# EasyEDA schematic 1-Schematic_MatrixBoard.json
TITLE: Sheet_1; REV: 1.0; Date: 2021-01-13; Sheet: 1/1; Drawn By: donkovs; Company: Your Company
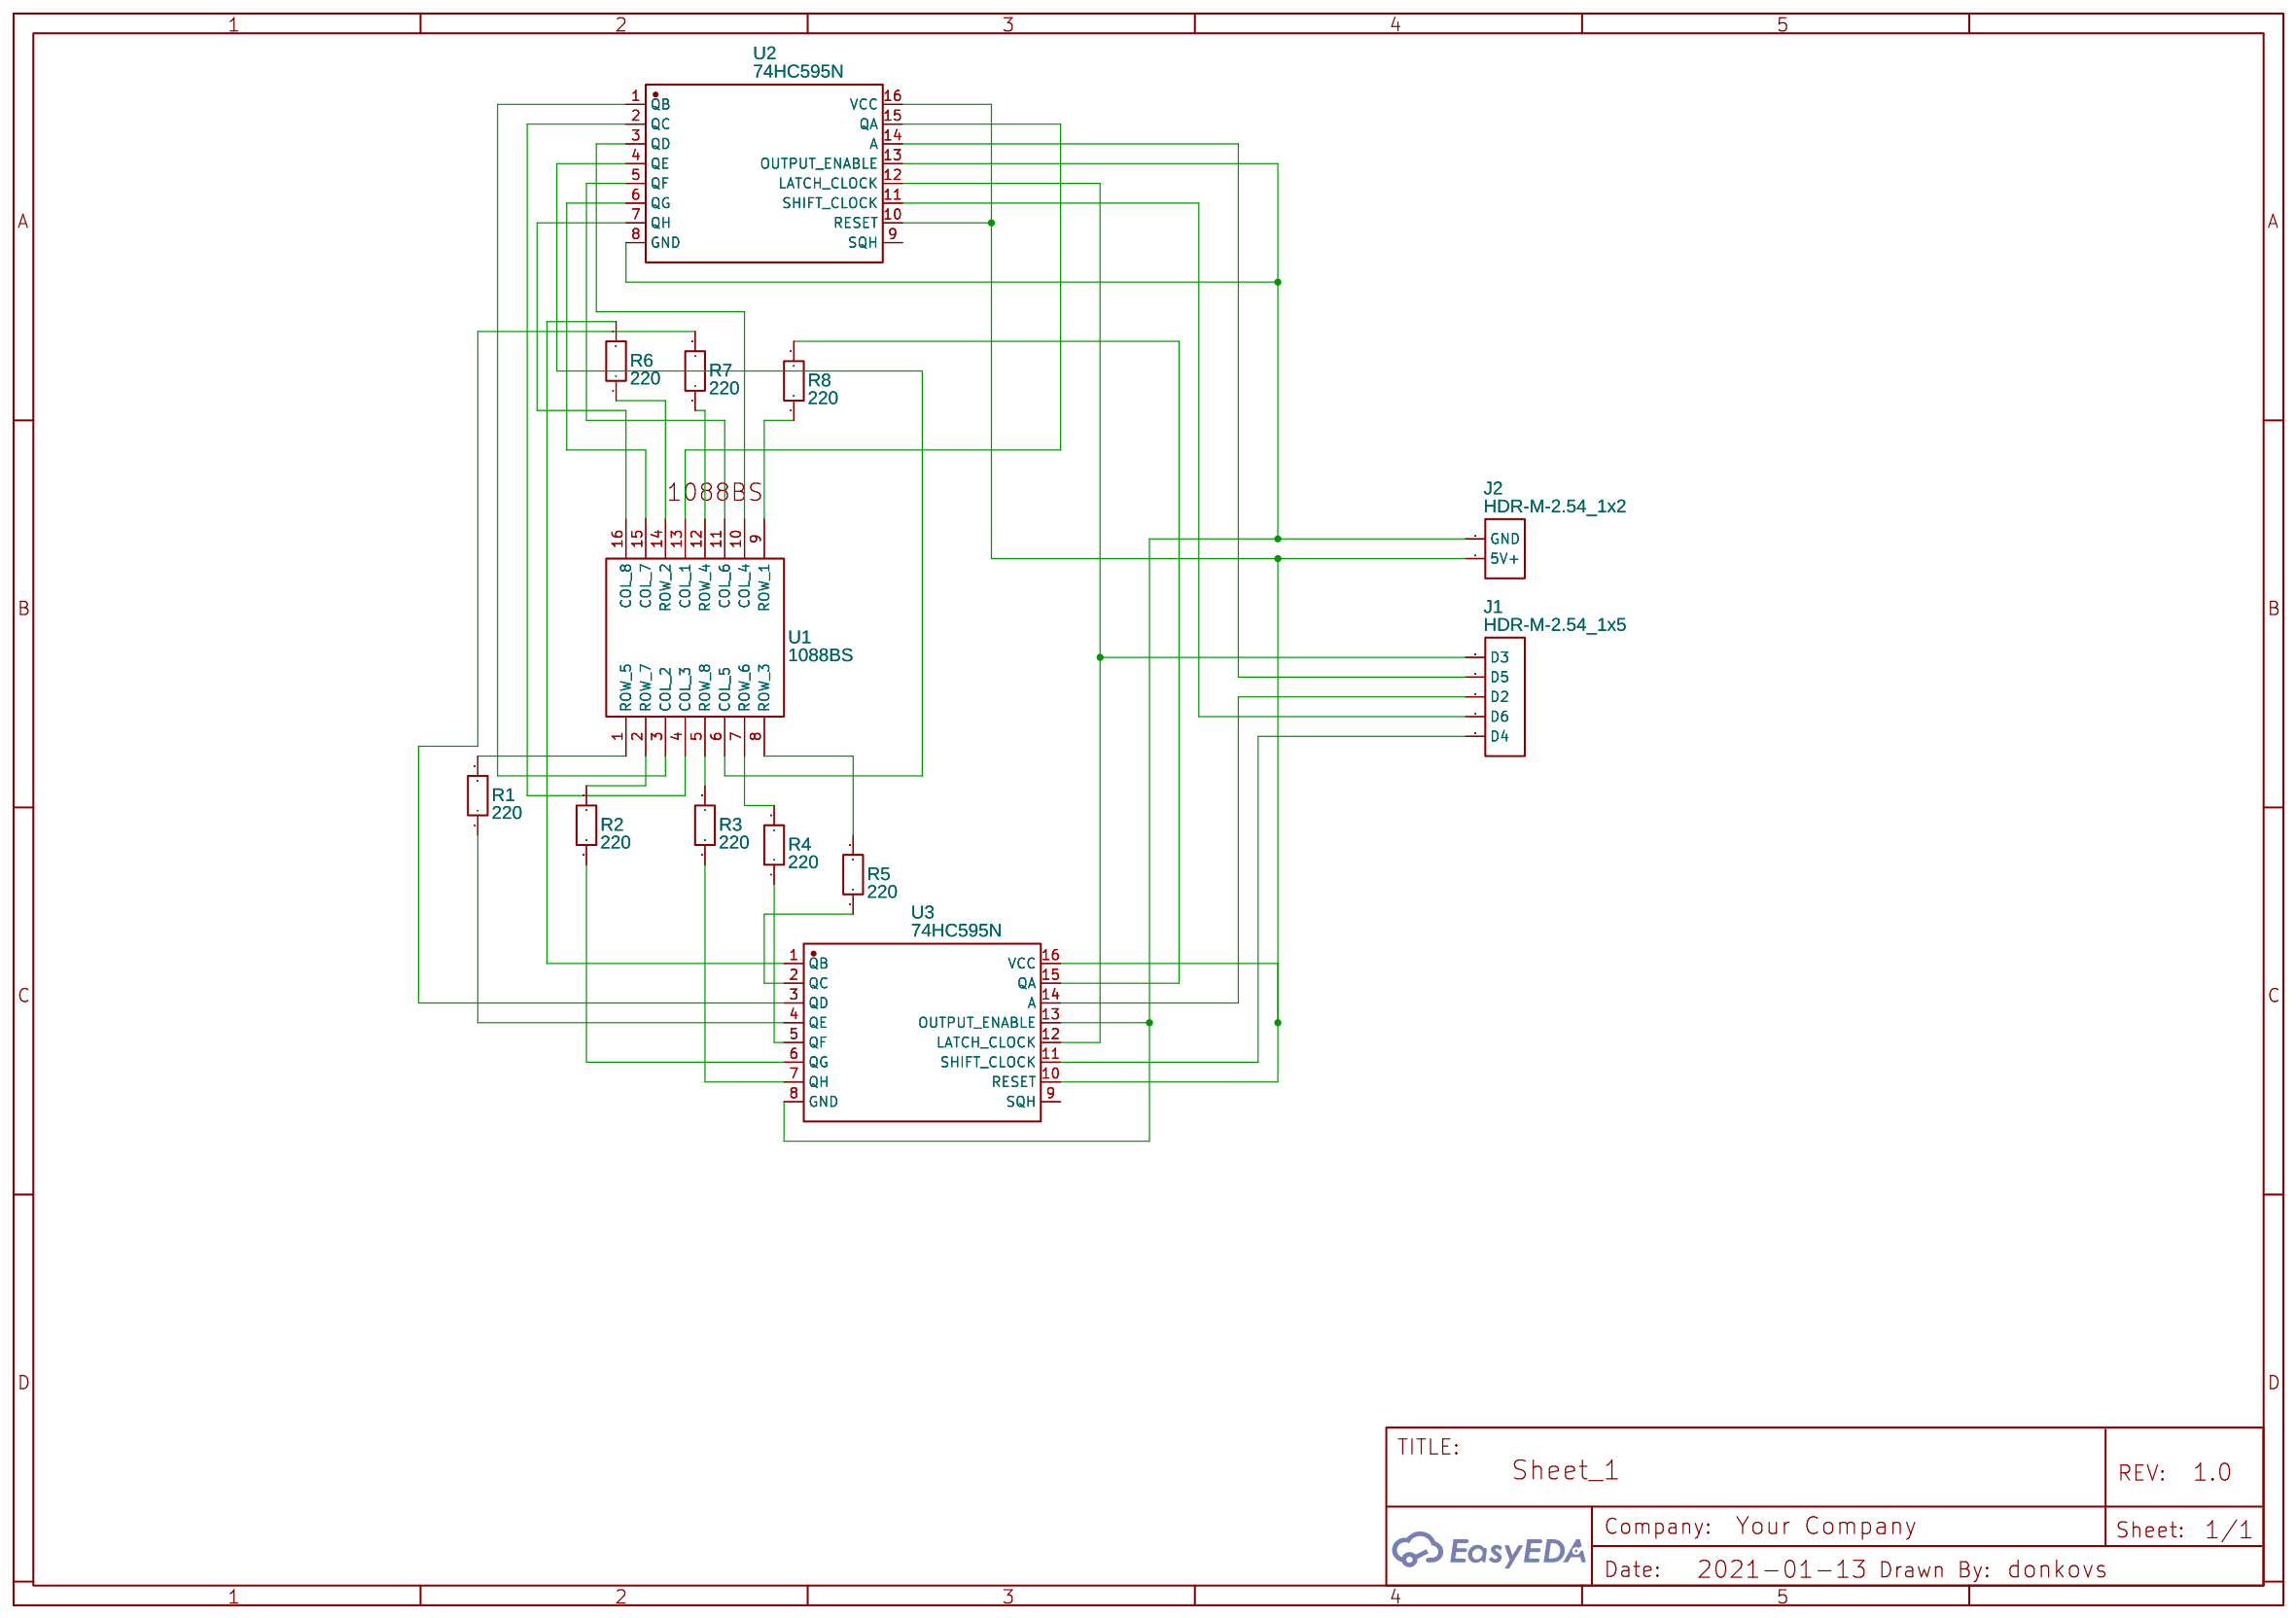
[diagram p0: schematic sheet]

## Parts
J1  HDR-M-2.54_1x5  [HDR-M-2.54_1X5]
J2  HDR-M-2.54_1x2  [HDR-M-2.54_1X2]
R1  220  [R0603]
R2  220  [R0603]
R3  220  [R0603]
R4  220  [R0603]
R5  220  [R0603]
R6  220  [R0603]
R7  220  [R0603]
R8  220  [R0603]
U1  1088BS  [8X8 MATRIX 3.2MM 1088AS 1088BS COPY]
U2  74HC595N  [DIP-16_L20.0-W6.4-P2.54-LS7.6-BL]
U3  74HC595N  [DIP-16_L20.0-W6.4-P2.54-LS7.6-BL]

## Library data of the parts
J1 = HDR-M-2.54_1x5: Supplier Part: C358687; Supplier: LCSC; Contributor: LCEDA_Lib
J2 = HDR-M-2.54_1x2: Supplier Part: C124375; Supplier: LCSC; Contributor: LCEDA_Lib
R1-R8 = R_0603_EU: Contributor: LCEDA_Lib
U1 = 1088BS: Contributor: bento_ee
U2 U3 = 74HC595N: Supplier: LCSC; Supplier Part: C507175; Manufacturer: HGSEMI; Contributor: LCSC

## Nets
Net-(J1-1): J1.1(D3) U2.12(LATCH_CLOCK) U3.12(LATCH_CLOCK)
Net-(J1-2): J1.2(D5) U2.14(A)
Net-(J1-3): J1.3(D2) U3.14(A)
Net-(J1-4): J1.4(D6) U2.11(SHIFT_CLOCK)
Net-(J1-5): J1.5(D4) U3.11(SHIFT_CLOCK)
Net-(J2-1): J2.1(GND) U2.8(GND) U2.13(OUTPUT_ENABLE) U3.8(GND) U3.13(OUTPUT_ENABLE)
Net-(J2-2): J2.2(5V+) U2.10(RESET) U2.16(VCC) U3.10(RESET) U3.16(VCC)
Net-(R1-1): R1.1 U3.4(QE)
Net-(R1-2): R1.2 U1.1(ROW_5)
Net-(R2-1): R2.1 U3.6(QG)
Net-(R2-2): R2.2 U1.2(ROW_7)
Net-(R3-1): R3.1 U3.7(QH)
Net-(R3-2): R3.2 U1.5(ROW_8)
Net-(R4-1): R4.1 U3.5(QF)
Net-(R4-2): R4.2 U1.7(ROW_6)
Net-(R5-1): R5.1 U3.2(QC)
Net-(R5-2): R5.2 U1.8(ROW_3)
Net-(R6-1): R6.1 U1.14(ROW_2)
Net-(R6-2): R6.2 U3.1(QB)
Net-(R7-1): R7.1 U1.12(ROW_4)
Net-(R7-2): R7.2 U3.3(QD)
Net-(R8-1): R8.1 U1.9(ROW_1)
Net-(R8-2): R8.2 U3.15(QA)
Net-(U1-3): U1.3(COL_2) U2.1(QB)
Net-(U1-4): U1.4(COL_3) U2.2(QC)
Net-(U1-6): U1.6(COL_5) U2.4(QE)
Net-(U1-10): U1.10(COL_4) U2.3(QD)
Net-(U1-11): U1.11(COL_6) U2.5(QF)
Net-(U1-13): U1.13(COL_1) U2.15(QA)
Net-(U1-15): U1.15(COL_7) U2.6(QG)
Net-(U1-16): U1.16(COL_8) U2.7(QH)

Not connected (* = marked no-connect by the designer): U2 9(SQH); U3 9(SQH)
